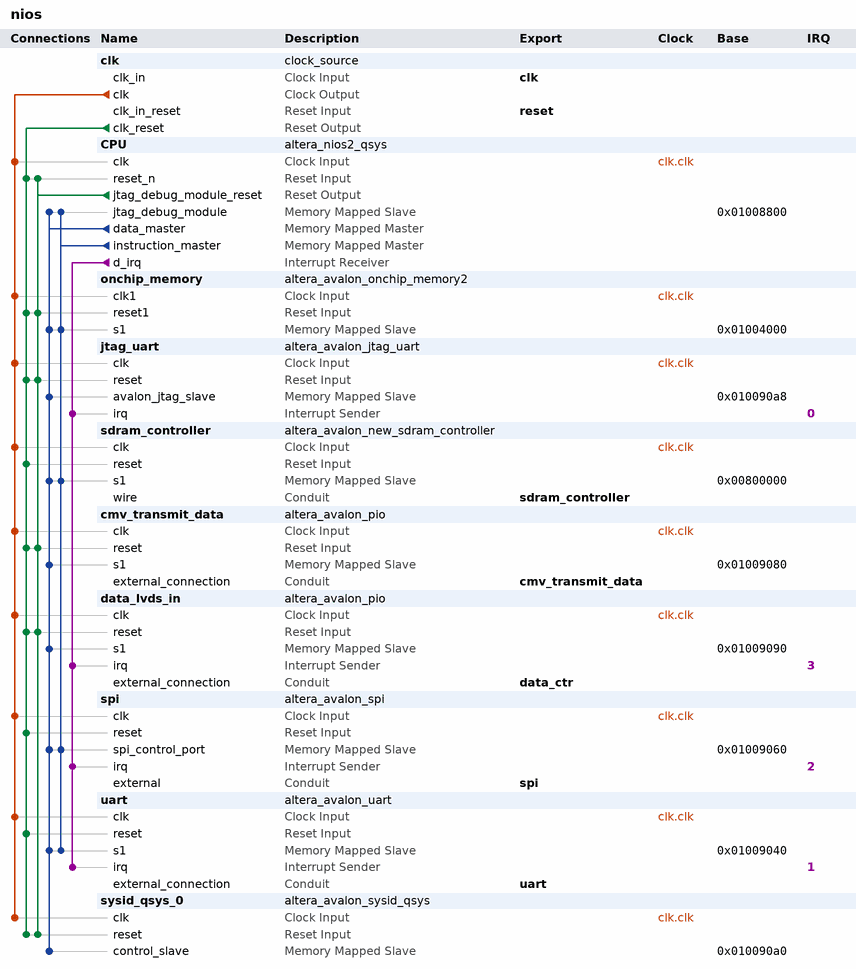
[diagram p0: system contents]
# Platform Designer (Qsys) system nios, Cyclone III EP3C16F484C6
# Parameters at their usual value, and those the tool derives, are not listed.
package require -exact qsys 13.0.1.99.2
create_system nios
set_project_property DEVICE_FAMILY {Cyclone III}
set_project_property DEVICE EP3C16F484C6

add_instance clk clock_source 13.0
set_instance_parameter_value clk clockFrequency 50000000

add_instance CPU altera_nios2_qsys 13.0
set_instance_parameter_value CPU manuallyAssignCpuID false
set_instance_parameter_value CPU resetSlave onchip_memory.s1
set_instance_parameter_value CPU mmu_TLBMissExcSlave None
set_instance_parameter_value CPU exceptionSlave onchip_memory.s1
set_instance_parameter_value CPU breakSlave CPU.jtag_debug_module
set_instance_parameter_value CPU impl Fast
set_instance_parameter_value CPU icache_size 4096
set_instance_parameter_value CPU dcache_bursts true

add_instance onchip_memory altera_avalon_onchip_memory2 13.0.1.99.2
set_instance_parameter_value onchip_memory dataWidth 32
set_instance_parameter_value onchip_memory dualPort false
set_instance_parameter_value onchip_memory initMemContent true
set_instance_parameter_value onchip_memory initializationFileName onchip_mem.hex
set_instance_parameter_value onchip_memory memorySize 10240

add_instance jtag_uart altera_avalon_jtag_uart 13.0.1.99.2
set_instance_parameter_value jtag_uart allowMultipleConnections true
set_instance_parameter_value jtag_uart simInteractiveOptions NO_INTERACTIVE_WINDOWS

add_instance sdram_controller altera_avalon_new_sdram_controller 13.0.1.99.2
set_instance_parameter_value sdram_controller TAC 5.5
set_instance_parameter_value sdram_controller TRCD 20.0
set_instance_parameter_value sdram_controller TRP 20.0
set_instance_parameter_value sdram_controller casLatency 3
set_instance_parameter_value sdram_controller columnWidth 8
set_instance_parameter_value sdram_controller dataWidth 16
set_instance_parameter_value sdram_controller generateSimulationModel true
set_instance_parameter_value sdram_controller model single_Micron_MT48LC4M32B2_7_chip
set_instance_parameter_value sdram_controller numberOfBanks 4
set_instance_parameter_value sdram_controller numberOfChipSelects 1
set_instance_parameter_value sdram_controller powerUpDelay 100.0
set_instance_parameter_value sdram_controller refreshPeriod 15.625
set_instance_parameter_value sdram_controller rowWidth 12

add_instance cmv_transmit_data altera_avalon_pio 13.0.1.99.2
set_instance_parameter_value cmv_transmit_data direction Output
set_instance_parameter_value cmv_transmit_data width 8

add_instance data_lvds_in altera_avalon_pio 13.0.1.99.2
set_instance_parameter_value data_lvds_in captureEdge true
set_instance_parameter_value data_lvds_in direction Input
set_instance_parameter_value data_lvds_in generateIRQ true
set_instance_parameter_value data_lvds_in irqType EDGE
set_instance_parameter_value data_lvds_in simDoTestBenchWiring true
set_instance_parameter_value data_lvds_in width 32

add_instance spi altera_avalon_spi 13.0.1.99.2
set_instance_parameter_value spi clockPolarity 0
set_instance_parameter_value spi dataWidth 8
set_instance_parameter_value spi masterSPI true
set_instance_parameter_value spi numberOfSlaves 1
set_instance_parameter_value spi targetClockRate 128000

add_instance uart altera_avalon_uart 13.0.1.99.2
set_instance_parameter_value uart baud 115200
set_instance_parameter_value uart dataBits 8
set_instance_parameter_value uart fixedBaud true
set_instance_parameter_value uart parity NONE
set_instance_parameter_value uart stopBits 1

add_instance sysid_qsys_0 altera_avalon_sysid_qsys 13.0
set_instance_parameter_value sysid_qsys_0 id -526922788

# connections
add_connection clk.clk cmv_transmit_data.clk clock
add_connection clk.clk CPU.clk clock
add_connection clk.clk data_lvds_in.clk clock
add_connection clk.clk jtag_uart.clk clock
add_connection clk.clk onchip_memory.clk1 clock
add_connection clk.clk sdram_controller.clk clock
add_connection clk.clk spi.clk clock
add_connection clk.clk sysid_qsys_0.clk clock
add_connection clk.clk uart.clk clock
add_connection clk.clk_reset cmv_transmit_data.reset reset
add_connection clk.clk_reset CPU.reset_n reset
add_connection clk.clk_reset data_lvds_in.reset reset
add_connection clk.clk_reset jtag_uart.reset reset
add_connection clk.clk_reset onchip_memory.reset1 reset
add_connection clk.clk_reset sdram_controller.reset reset
add_connection clk.clk_reset spi.reset reset
add_connection clk.clk_reset sysid_qsys_0.reset reset
add_connection clk.clk_reset uart.reset reset
add_connection CPU.jtag_debug_module_reset cmv_transmit_data.reset reset
add_connection CPU.jtag_debug_module_reset CPU.reset_n reset
add_connection CPU.jtag_debug_module_reset data_lvds_in.reset reset
add_connection CPU.jtag_debug_module_reset jtag_uart.reset reset
add_connection CPU.jtag_debug_module_reset onchip_memory.reset1 reset
add_connection CPU.jtag_debug_module_reset sysid_qsys_0.reset reset
add_connection CPU.data_master cmv_transmit_data.s1 avalon
set_connection_parameter_value CPU.data_master/cmv_transmit_data.s1 baseAddress 0x01009080
add_connection CPU.data_master CPU.jtag_debug_module avalon
set_connection_parameter_value CPU.data_master/CPU.jtag_debug_module baseAddress 0x01008800
add_connection CPU.data_master data_lvds_in.s1 avalon
set_connection_parameter_value CPU.data_master/data_lvds_in.s1 baseAddress 0x01009090
add_connection CPU.data_master jtag_uart.avalon_jtag_slave avalon
set_connection_parameter_value CPU.data_master/jtag_uart.avalon_jtag_slave baseAddress 0x010090a8
add_connection CPU.data_master onchip_memory.s1 avalon
set_connection_parameter_value CPU.data_master/onchip_memory.s1 baseAddress 0x01004000
add_connection CPU.data_master sdram_controller.s1 avalon
set_connection_parameter_value CPU.data_master/sdram_controller.s1 baseAddress 0x00800000
add_connection CPU.data_master spi.spi_control_port avalon
set_connection_parameter_value CPU.data_master/spi.spi_control_port baseAddress 0x01009060
add_connection CPU.data_master sysid_qsys_0.control_slave avalon
set_connection_parameter_value CPU.data_master/sysid_qsys_0.control_slave baseAddress 0x010090a0
add_connection CPU.data_master uart.s1 avalon
set_connection_parameter_value CPU.data_master/uart.s1 baseAddress 0x01009040
add_connection CPU.instruction_master CPU.jtag_debug_module avalon
set_connection_parameter_value CPU.instruction_master/CPU.jtag_debug_module baseAddress 0x01008800
add_connection CPU.instruction_master onchip_memory.s1 avalon
set_connection_parameter_value CPU.instruction_master/onchip_memory.s1 baseAddress 0x01004000
add_connection CPU.instruction_master sdram_controller.s1 avalon
set_connection_parameter_value CPU.instruction_master/sdram_controller.s1 baseAddress 0x00800000
add_connection CPU.instruction_master spi.spi_control_port avalon
set_connection_parameter_value CPU.instruction_master/spi.spi_control_port baseAddress 0x01009060
add_connection CPU.instruction_master uart.s1 avalon
set_connection_parameter_value CPU.instruction_master/uart.s1 baseAddress 0x01009040
add_connection CPU.d_irq data_lvds_in.irq interrupt
set_connection_parameter_value CPU.d_irq/data_lvds_in.irq irqNumber 3
add_connection CPU.d_irq jtag_uart.irq interrupt
set_connection_parameter_value CPU.d_irq/jtag_uart.irq irqNumber 0
add_connection CPU.d_irq spi.irq interrupt
set_connection_parameter_value CPU.d_irq/spi.irq irqNumber 2
add_connection CPU.d_irq uart.irq interrupt
set_connection_parameter_value CPU.d_irq/uart.irq irqNumber 1

# exported interfaces
add_interface clk clock sink
set_interface_property clk EXPORT_OF clk.clk_in
add_interface reset reset sink
set_interface_property reset EXPORT_OF clk.clk_in_reset
add_interface data_ctr conduit end
set_interface_property data_ctr EXPORT_OF data_lvds_in.external_connection
add_interface uart conduit end
set_interface_property uart EXPORT_OF uart.external_connection
add_interface sdram_controller conduit end
set_interface_property sdram_controller EXPORT_OF sdram_controller.wire
add_interface spi conduit end
set_interface_property spi EXPORT_OF spi.external
add_interface cmv_transmit_data conduit end
set_interface_property cmv_transmit_data EXPORT_OF cmv_transmit_data.external_connection

set_interconnect_requirement {$system} qsys_mm.clockCrossingAdapter HANDSHAKE
set_interconnect_requirement {$system} qsys_mm.maxAdditionalLatency 1

save_system nios.qsys
